# EAGLE design Schematic (EAGLE 5.10)
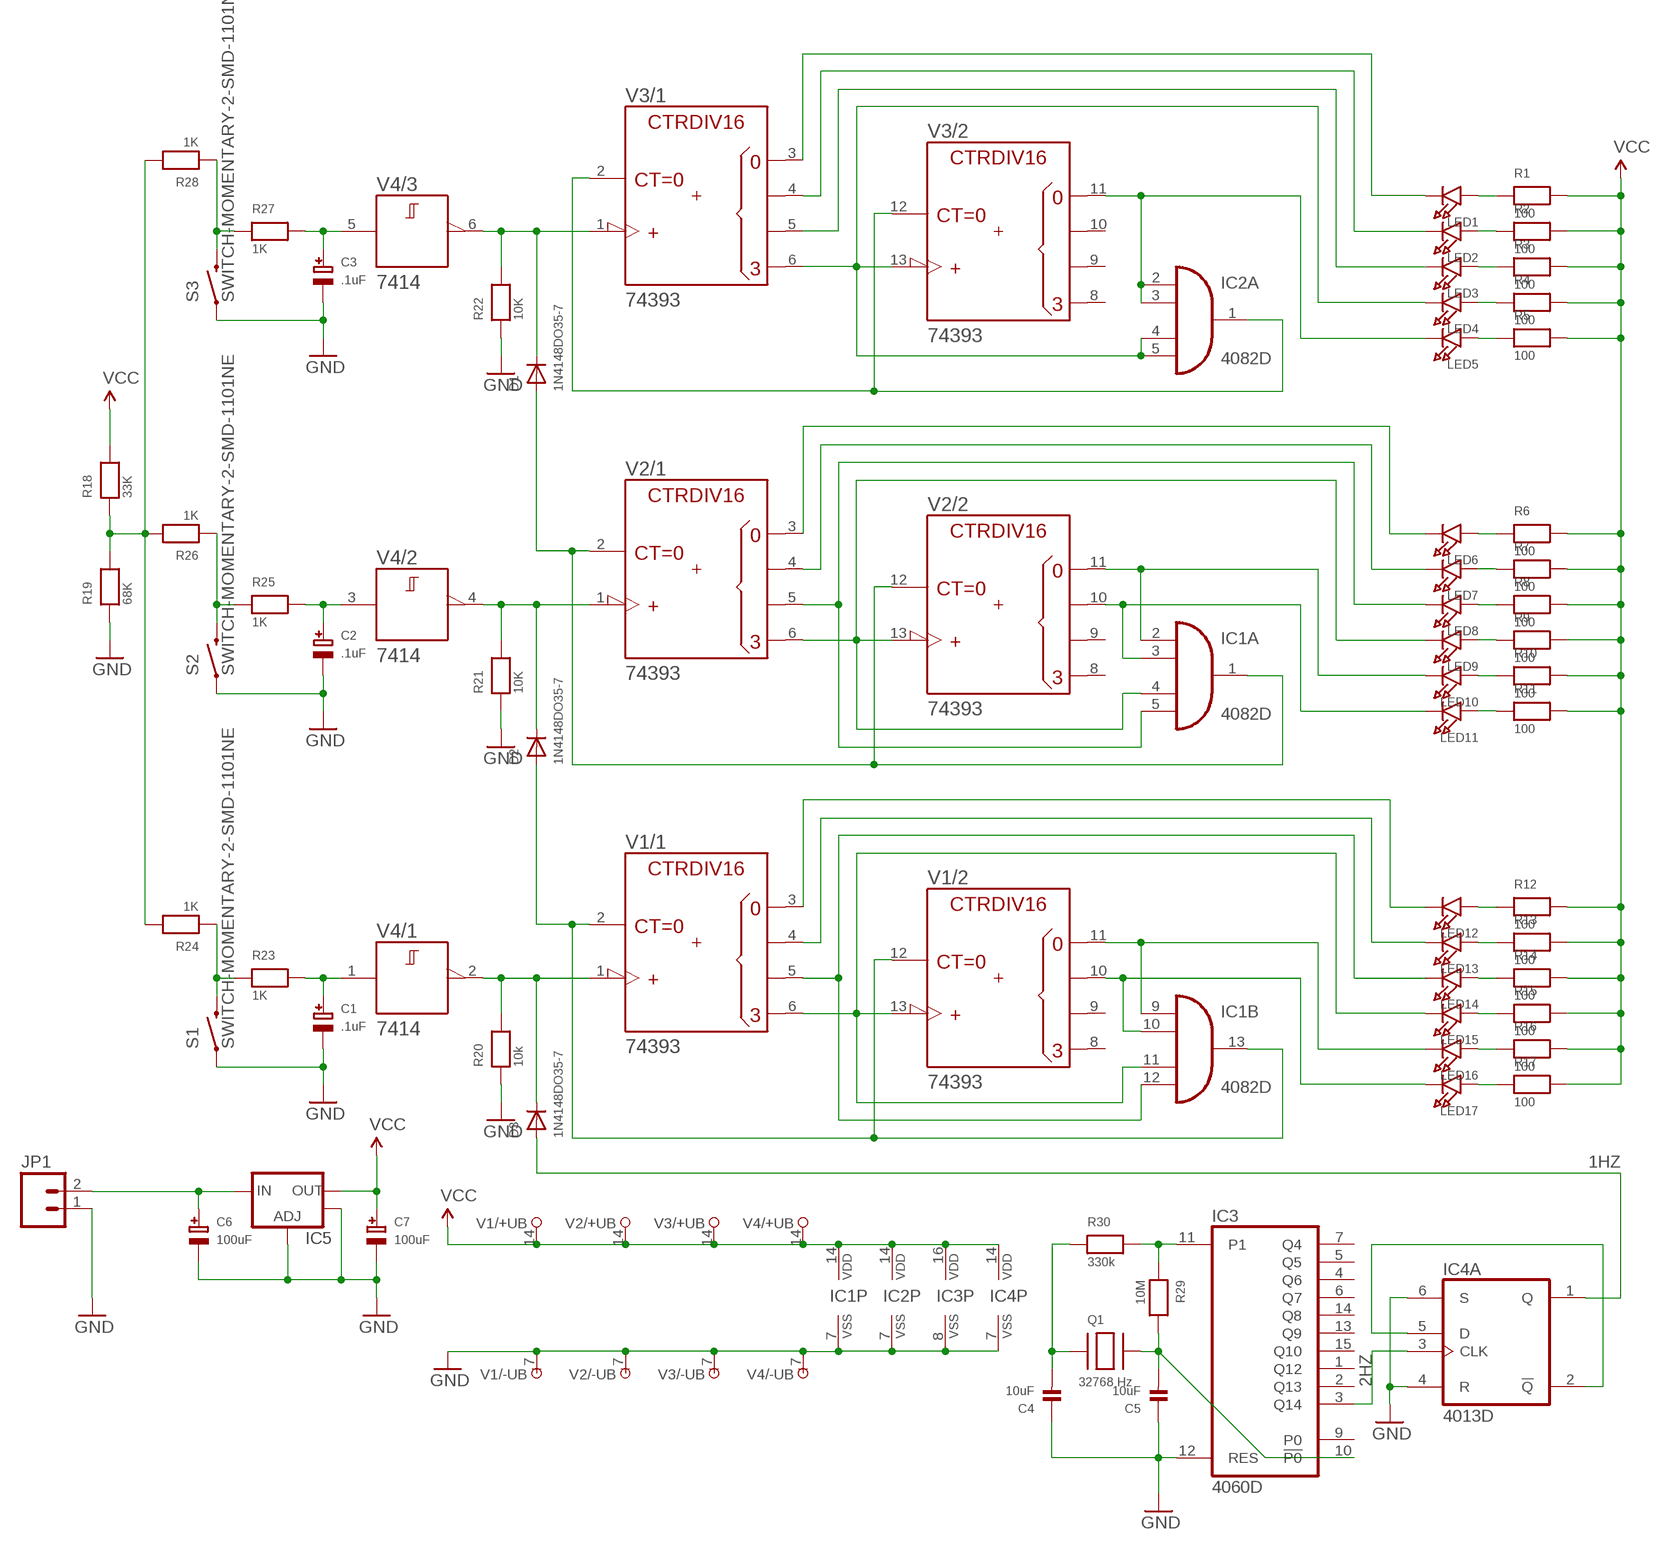
[diagram p0: schematic, sheet 1]

## Parts
C1  .1uF  CAP_TANTALUMA/3216_REFLOW  [EIA3216-18/A-R]
C2  .1uF  CAP_TANTALUMA/3216_REFLOW  [EIA3216-18/A-R]
C3  .1uF  CAP_TANTALUMA/3216_REFLOW  [EIA3216-18/A-R]
C4  10uF  CAP_CERAMIC0805  [0805]
C5  10uF  CAP_CERAMIC0805  [0805]
C6  100uF  CAP_ELECTROLYTICPANASONIC_D  [PANASONIC_D]
C7  100uF  CAP_ELECTROLYTICPANASONIC_D  [PANASONIC_D]
D1  1N4148DO35-7  DIODESOD-123  [SOD-123]
D2  1N4148DO35-7  DIODESOD-123  [SOD-123]
D3  1N4148DO35-7  DIODESOD-123  [SOD-123]
IC1  4082D  [SO14]
IC2  4082D  [SO14]
IC3  4060D  [SO16]
IC4  4013D  [SO14]
IC5  V_REG_LM1117SOT223  [SOT223]
JP1  M025MM  [SCREWTERMINAL-5MM-2]
LED1  LED0805  [CHIPLED_0805]
LED2  LED0805  [CHIPLED_0805]
LED3  LED0805  [CHIPLED_0805]
LED4  LED0805  [CHIPLED_0805]
LED5  LED0805  [CHIPLED_0805]
LED6  LED0805  [CHIPLED_0805]
LED7  LED0805  [CHIPLED_0805]
LED8  LED0805  [CHIPLED_0805]
LED9  LED0805  [CHIPLED_0805]
LED10  LED0805  [CHIPLED_0805]
LED11  LED0805  [CHIPLED_0805]
LED12  LED0805  [CHIPLED_0805]
LED13  LED0805  [CHIPLED_0805]
LED14  LED0805  [CHIPLED_0805]
LED15  LED0805  [CHIPLED_0805]
LED16  LED0805  [CHIPLED_0805]
LED17  LED0805  [CHIPLED_0805]
Q1  32768 Hz  XTAL-3.2X1.5  [XTAL3215]
R1  100  RESISTOR0805  [0805]
R2  100  RESISTOR0805  [0805]
R3  100  RESISTOR0805  [0805]
R4  100  RESISTOR0805  [0805]
R5  100  RESISTOR0805  [0805]
R6  100  RESISTOR0805  [0805]
R7  100  RESISTOR0805  [0805]
R8  100  RESISTOR0805  [0805]
R9  100  RESISTOR0805  [0805]
R10  100  RESISTOR0805  [0805]
R11  100  RESISTOR0805  [0805]
R12  100  RESISTOR0805  [0805]
R13  100  RESISTOR0805  [0805]
R14  100  RESISTOR0805  [0805]
R15  100  RESISTOR0805  [0805]
R16  100  RESISTOR0805  [0805]
R17  100  RESISTOR0805  [0805]
R18  33K  RESISTOR0805  [0805]
R19  68K  RESISTOR0805  [0805]
R20  10k  RESISTOR0805  [0805]
R21  10K  RESISTOR0805  [0805]
R22  10K  RESISTOR0805  [0805]
R23  1K  RESISTOR0805  [0805]
R24  1K  RESISTOR0805  [0805]
R25  1K  RESISTOR0805  [0805]
R26  1K  RESISTOR0805  [0805]
R27  1K  RESISTOR0805  [0805]
R28  1K  RESISTOR0805  [0805]
R29  10M  RESISTOR0805  [0805]
R30  330k  RESISTOR0805  [0805]
S1  SWITCH-MOMENTARY-2-SMD-1101NE  [TACTILE-SWITCH-1101NE]
S2  SWITCH-MOMENTARY-2-SMD-1101NE  [TACTILE-SWITCH-1101NE]
S3  SWITCH-MOMENTARY-2-SMD-1101NE  [TACTILE-SWITCH-1101NE]
V1  74393  [SO14]
V2  74393  [SO14]
V3  74393  [SO14]
V4  7414  [SO14]

## Nets
1HZ: D3.A IC4.1(A:Q)
2HZ: IC3.3(Q14) IC4.3(A:CLK)
GND: C1.- C2.- C3.- C4.1 C5.1 C6.- C7.- IC1.7(P:VSS) IC2.7(P:VSS) IC3.8(VSS) IC3.12(RES) IC4.4(A:R) IC4.6(A:S) IC4.7(P:VSS) IC5.1(ADJ) IC5.4(OUT) JP1.1 R19.1 R20.1 R21.1 R22.1 S1.P$1 S2.P$1 S3.P$1 V1.7(/-UB:-UB) V2.7(/-UB:-UB) V3.7(/-UB:-UB) V4.7(/-UB:-UB)
N$1: IC1.9(B:I0) LED16.C V1.11(/2:QA)
N$2: LED12.C V1.3(/1:QA)
N$3: IC1.12(B:I3) LED14.C V1.5(/1:QC)
N$4: C6.+ IC5.3(IN) JP1.2
N$6: LED13.A R13.1
N$7: LED7.C V2.4(/1:QB)
N$8: LED6.C V2.3(/1:QA)
N$9: LED12.A R12.1
N$10: LED14.A R14.1
N$11: LED15.A R15.1
N$12: LED16.A R16.1
N$13: LED17.A R17.1
N$14: R25.1 R26.1 S2.P$2
N$15: C5.2 IC3.10(!P0) Q1.P$2 R29.2
N$16: IC1.4(A:I2) LED9.C V2.6(/1:QD) V2.13(/2:A)
N$19: IC2.4(A:I2) IC2.5(A:I3) LED4.C V3.6(/1:QD) V3.13(/2:A)
N$20: IC1.3(A:I1) LED11.C V2.10(/2:QB)
N$23: LED1.C V3.3(/1:QA)
N$24: LED1.A R1.1
N$25: IC2.2(A:I0) IC2.3(A:I1) LED5.C V3.11(/2:QA)
N$26: LED2.C V3.4(/1:QB)
N$27: LED3.C V3.5(/1:QC)
N$28: R27.1 R28.1 S3.P$2
N$30: LED2.A R2.1
N$32: LED3.A R3.1
N$33: LED4.A R4.1
N$34: LED5.A R5.1
N$35: IC4.2(A:!Q) IC4.5(A:D)
N$38: IC1.5(A:I3) LED8.C V2.5(/1:QC)
N$40: IC1.2(A:I0) LED10.C V2.11(/2:QA)
N$41: C2.+ R25.2 V4.3(/2:A)
N$43: R18.1 R19.2 R24.2 R26.2 R28.2
N$44: R23.1 R24.1 S1.P$2
N$45: D2.C R21.2 V2.1(/1:A) V4.4(/2:Y)
N$46: IC3.11(P1) R29.1 R30.2
N$47: D2.A IC1.13(B:O) V1.2(/1:CLR) V1.12(/2:CLR)
N$49: D1.A IC1.1(A:O) V2.2(/1:CLR) V2.12(/2:CLR)
N$50: C3.+ R27.2 V4.5(/3:A)
N$51: C1.+ R23.2 V4.1(/1:A)
N$53: IC2.1(A:O) V3.2(/1:CLR) V3.12(/2:CLR)
N$56: C4.2 Q1.P$1 R30.1
N$57: D1.C R22.2 V3.1(/1:A) V4.6(/3:Y)
N$59: D3.C R20.2 V1.1(/1:A) V4.2(/1:Y)
N$61: LED6.A R6.1
N$62: LED7.A R7.1
N$63: LED8.A R8.1
N$64: LED9.A R9.1
N$65: LED10.A R10.1
N$66: LED11.A R11.1
N$70: IC1.10(B:I1) LED17.C V1.10(/2:QB)
N$74: IC1.11(B:I2) LED15.C V1.6(/1:QD) V1.13(/2:A)
N$76: LED13.C V1.4(/1:QB)
VCC: C7.+ IC1.14(P:VDD) IC2.14(P:VDD) IC3.16(VDD) IC4.14(P:VDD) IC5.2(OUT) R1.2 R2.2 R3.2 R4.2 R5.2 R6.2 R7.2 R8.2 R9.2 R10.2 R11.2 R12.2 R13.2 R14.2 R15.2 R16.2 R17.2 R18.2 V1.14(/+UB:+UB) V2.14(/+UB:+UB) V3.14(/+UB:+UB) V4.14(/+UB:+UB)
Unconnected: IC2.9(B:I0) IC2.10(B:I1) IC2.11(B:I2) IC2.12(B:I3) IC2.13(B:O) IC3.1(Q12) IC3.2(Q13) IC3.4(Q6) IC3.5(Q5) IC3.6(Q7) IC3.7(Q4) IC3.9(P0) IC3.13(Q9) IC3.14(Q8) IC3.15(Q10) IC4.8(B:S) IC4.9(B:D) IC4.10(B:R) IC4.11(B:CLK) IC4.12(B:!Q) IC4.13(B:Q) V1.8(/2:QD) V1.9(/2:QC) V2.8(/2:QD) V2.9(/2:QC) V3.8(/2:QD) V3.9(/2:QC) V3.10(/2:QB) V4.8(/4:Y) V4.9(/4:A) V4.10(/5:Y) V4.11(/5:A) V4.12(/6:Y) V4.13(/6:A)

## Library data of the parts
C1-C3 = microbuilder:CAP_TANTALUM: Tantalum Capacitors Wave footprints have larger pads and are meant to be used for hand soldering. Reflow footprints are optimised for solder paste and a reflow oven. EIA3216-18/A-[R/W] - Size A / 3216-18 / 1206 footprint 4.7µF 25V 10% Tantalum Capacitor 10µF 16V 10% Tantalum Capacitor [Digikey: 495-2236-2-ND] EIA3528-21/B-[R/W] - Size B / 3528-21 47µF 10V 10% Tantalum Capactior [Digikey: 495-2216-1-ND] EIA6032-28/C-[R/W] - Size C / 6032-28 10µF 35V 20% Tantalum Capacitor [Digikey: 495-2285-1-ND] 100µF 16V 10% Tantalum Capactior [Digikey: 399-5214-1-ND]
C4 C5 = microbuilder:CAP_CERAMIC: Ceramic Capacitors 0402 - 0402 Surface Mount Capacitors 0.1uF 10V 10% [Digikey: 490-1318-2-ND] 0603 - 0603 Surface Mount Capacitors 16 pF 50V 5% [Digikey: 445-5051-2-ND] 22 pF 50V [Digikey: PCC220ACVTR-ND] 33 pF 50V 5% [Digikey: 490-1415-1-ND] 56pF 50V 5% [Digikey: 490-1421-1-ND] 220pF 50V 5% [Digikey: 445-1285-1-ND] 680 pF 50V 2200 pF 50V 5% C0G [Digikey: 445-1297-1-ND] 5600 pF 100V 5% X7R [Digikey: 478-3711-1-ND] 0.1 µF 25V 10% [Digikey: PCC2277TR-ND] 0.22 µF 16V 10% X7R [Digikey: 445-1318-1-ND] 1.0 µF 25V 10% [Digikey: 445-5146-2-ND] 0603 - RF Specific 3pF 250V +/-0.1pF RF [Digikey: 712-1347-1-ND] 18 pF 250V 5% [Digikey: 478-3505-1-ND or 712-1322-1-ND] 56 pF 250V 5% C0G RF [Digikey: 490-4867-1-ND] 68 pF 250V RF [Digikey: 490-4868-1-ND] 0805 - 0805 Surface Mount Capacitors 220 pF 250V 2% RF Ceramic Capacitor [Digikey: 712-1398-1-ND] 1000 pF 50V 2% NP0 Ceramic Capacitor [Digikey: 478-3760-1-ND] 0.1 µF 25V 10% Ceramic Capacitor [Digikey: PCC1828TR-ND] 1.0 µF 16V 10% Ceramic Capacitor[Digikey: 490-1691-2-ND] 10.0 µF 10V 10% Ceramic Capacitor[Digikey: 709-1228-1-ND] 1206 - 1206 Surface Mount Capacitors
C6 C7 = microbuilder:CAP_ELECTROLYTIC: Electrolytic Capacitors PANASONIC_C - Size C Panasonic Electrolytic Aluminum Capacitor 47µF 16V 20% Electrolytic Capacitor [Digikey: PCE3890TR-ND] PANASONIC_D - Size D Panasonic Electrolytic Aluminum Capacitor 100µF 25V 20% Electrolytic Capacitor [Digikey: PCE3898TR-ND]
D1-D3 = microbuilder:DIODE: Diode SMADIODE - SMA Surface Mount Package 20V 1A Schottky Diode Digikey (500mV @ 1A, 500uA Vr @ 20V): 641-1014-6-ND SOD-123 30V 500mA (430mV Vf, 130uA Vr @ 30V) Schottky Diode - Digikey: B0530W-FDICT-ND SOD-323 10V 570mA (380mV Vf, 3ns) Schottky Diode - Digikey: ZLLS410CT-ND SOD-523 30V 30mA Schottky Diode (RB751S-40TE61) - Digikey: RB751S-40TE61CT-ND SOT23-R/W - SOT23 Package (R = Solder Paste/Reflow Ovens, W = Hand-Soldering) BAT54Film 40V 300mA - Digikey: 497-7162-1-ND DO-1N4148 Through Hole Small Current Diode (any model)
IC1 IC2 = 40xx:4082: Dual 4-input AND
IC3 = 40xx:4060: 14-stage binary/ripple COUNTER
IC4 = 40xx:4013: Dual D FLIP FLOP, set/reset
IC5 = SparkFun:V_REG_LM1117: Voltage Regulator LM1117 Standard adjustable voltage regulator but in SMD form. Spark Fun Electronics SKU : COM-00595
JP1 = SparkFun:M02: Header 2 Standard 2-pin 0.1" header. Use with straight break away headers (SKU : PRT-00116), right angle break away headers (PRT-00553), swiss pins (PRT-00743), machine pins (PRT-00117), and female headers (PRT-00115). Molex polarized connector foot print use with SKU : PRT-08233 with associated crimp pins and housings.
LED1-LED17 = microbuilder:LED: LED 0603 - 0603 Surface Mount Package Green LED - Low Power (3.9mcd, 2ma, 1.7Vf) Orange LED - Low Power (9.8mcd, 2ma, 1.8Vf) Red LED - Low Power (5mcd, 2ma, 1.8Vf) Yellow LED - Low Power (7mcd, 2ma, 1.8Vf) 0805 - 0805 Surface Mount Package 20mA: Red LED (104mcd, 20mA, Diffused) - LS R976 [Digikey: 475-1278-6-ND] Red LED (12mcd, 20mA, 2.0Vf, Clear) - APT2012EC [Digikey: 754-1128-1-ND] Green LED (15mcd, 20mA, 2.2Vf, Clear) - APT2012GC [Digikey: 754-1131-1-ND] Orange LED (160mcd, 20mA, 2.1Vf, Clear) - APT2012SECK [Digikey: 754-1130-1-ND] 2mA: Red LED (8.8mcd, 2mA, 1.8Vf, Clear) - Low Power [Digikey: 475-2510-1-ND] Green LED (5mcd, 2mA, 1.8Vf, Clear) - Low Power [Digikey: 475-2730-1-ND] Yellow LED (11.3mcd, 2mA, 1.8Vf, Clear) - Low Power [Digikey: 475-2555-1-ND] 1206 - 1206 Surface Mount Package Green LED (26mcd, 20mA, Diffused) - LG N971 [Digikey: 475-1407-6-ND] Red LED (15mcd, 20mA, Diffused) - LH N974 [Digikey: 475-1416-6-ND]
Q1 = adafruit:XTAL: Low cost SMT crystals, no capacitors included http://www.ladyada.net/library/eagle
R1-R30 = microbuilder:RESISTOR: Resistors 0402 - 0402 Surface Mount Package 10.0K 1% 1/16W [Digikey: 311-10.0KLRTR-ND] 0603 - 0603 Surface Mount Package 0 Ohm 1/10 Watt 1% Resistor 15 Ohm 1/10 Watt 1% Resistor 33 Ohm 1/10 Watt 1% Resistor 49.9 Ohm 1/10 Watt 1% Resistor 100 Ohm 1/10 Watt 1% Resistor 150 Ohm 1/10 Watt 1% Resistor 240 Ohm 1/10 Watt 1% Resistor 390 Ohm 1/10 Watt 1% Resistor 560 Ohm 1/10 Watt 1% Resistor 750 Ohm 1/10 Watt 1% Resistor 1.0K Ohm 1/10 Watt 1% Resistor 1.5K Ohm 1/10 Watt 1% Resistor 2.0K Ohm 1/10 Watt 1% Resistor 4.7K Ohm 1/10 Watt 1% Resistor 10.0K Ohm 1/10 Watt 1% Resistor 20.0K Ohm 1/10 Watt 1% Resistor 33.0K Ohm 1/10 Watt 1% Resistor 100.0K Ohm 1/10 Watt 1% Resistor 0805 - 0805 Surface Mount Package 0 Ohm 1/8 Watt 1% Resistor 33 Ohm 1/8 Watt 1% Resistor 100 Ohm 1/8 Watt 1% Resistor 150 Ohm 1/8 Watt 1% Resistor 200 Ohm 1/8 Watt 1% Resistor 240 Ohm 1/8 Watt 1% Resistor 330 Ohm 1/8 Watt 1% Resistor 390 Ohm 1/8 Watt 1% Resistor 470 Ohm 1/8 Watt 1% Resistor 1.0K Ohm 1/8 Watt 1% Resistor 1.5K Ohm 1/8 Watt 1% Resistor 2.0K Ohm 1/8 Watt 1% Resistor 4.7K Ohm 1/8 Watt 1% Resistor 5.1K Ohm 1/8 Watt 1% Resistor 5.6K Ohm 1/8 Watt 1% Resistor 10.0K Ohm 1/8 Watt 1% Resistor 22.0K Ohm 1/8 Watt 1% Resistor 33.0K Ohm 1/8 Watt 1% Resistor 100K Ohm 1/8 Watt 1% Resistor 1206 - 1206 Surface Mount Package
S1-S3 = SparkFun:SWITCH-MOMENTARY-2
V1-V3 = 74ttl-din:74*393: Dual 4-bit decade and binary COUNTER
V4 = 74ttl-din:74*14: Hex schmitt trigger INVERTER

## Board
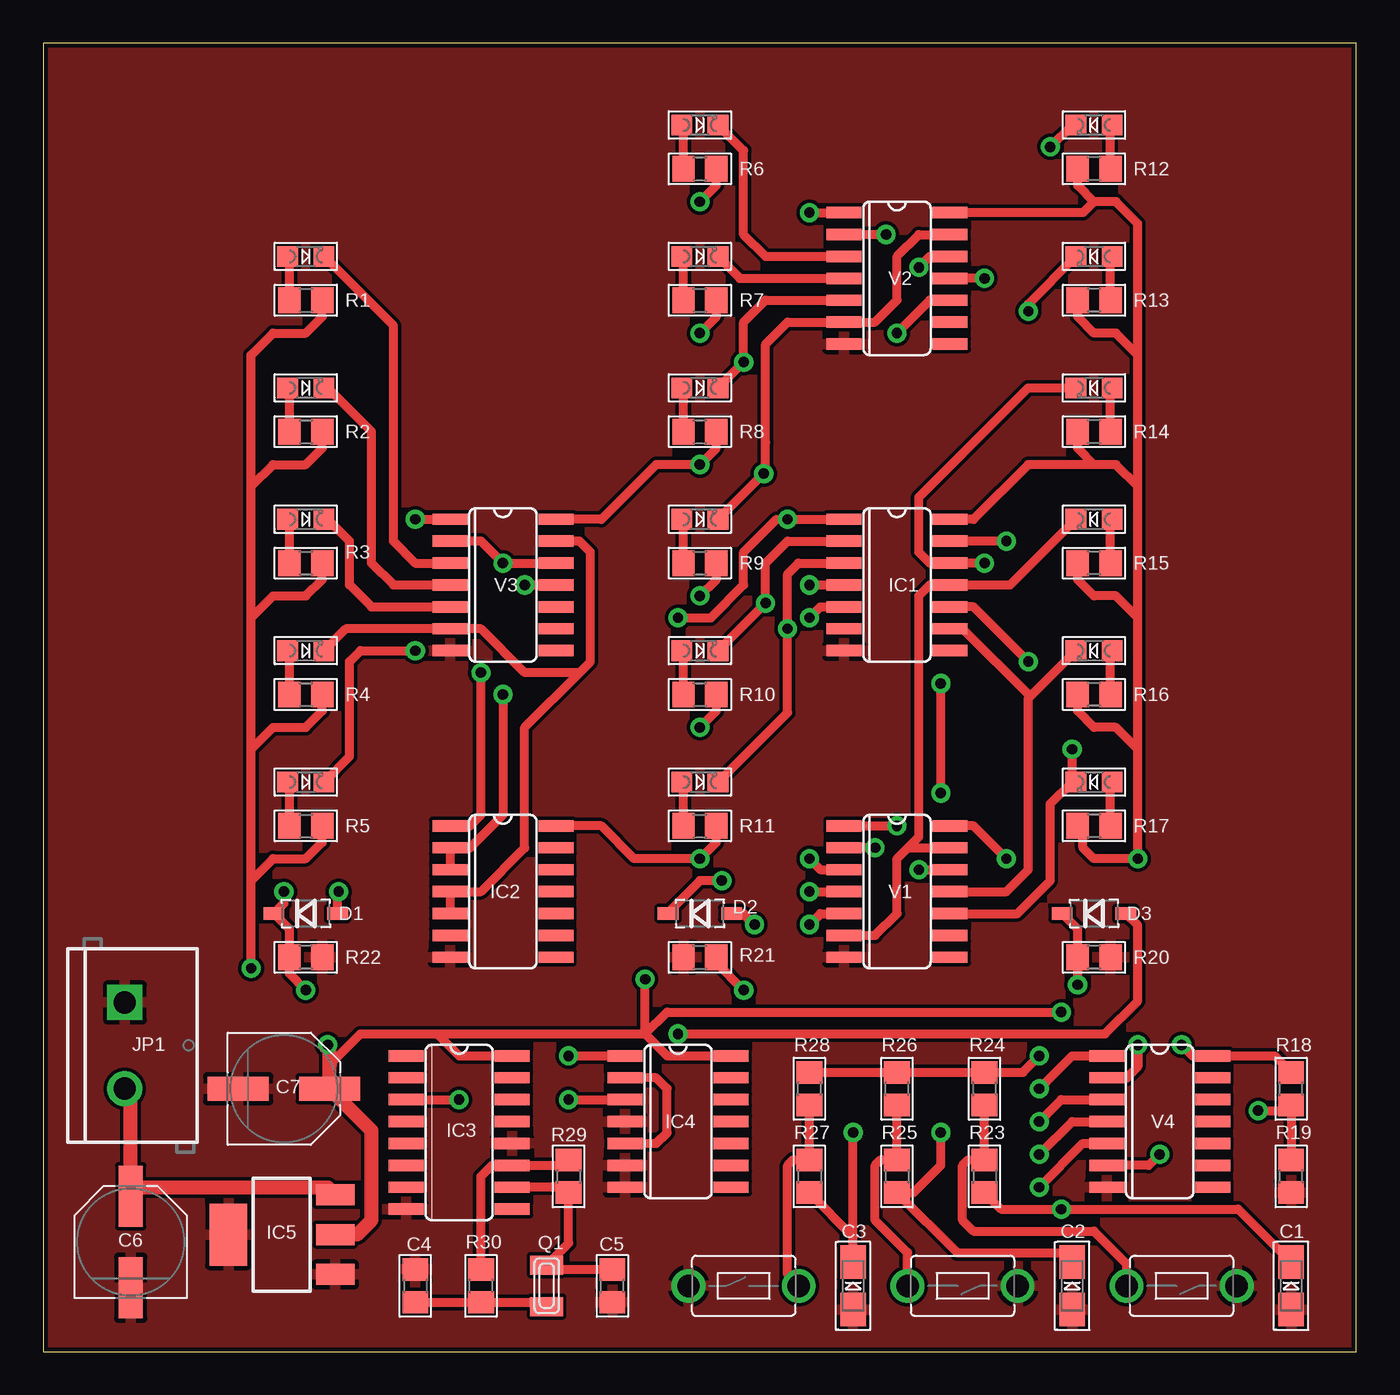
[diagram p1: board, top side]
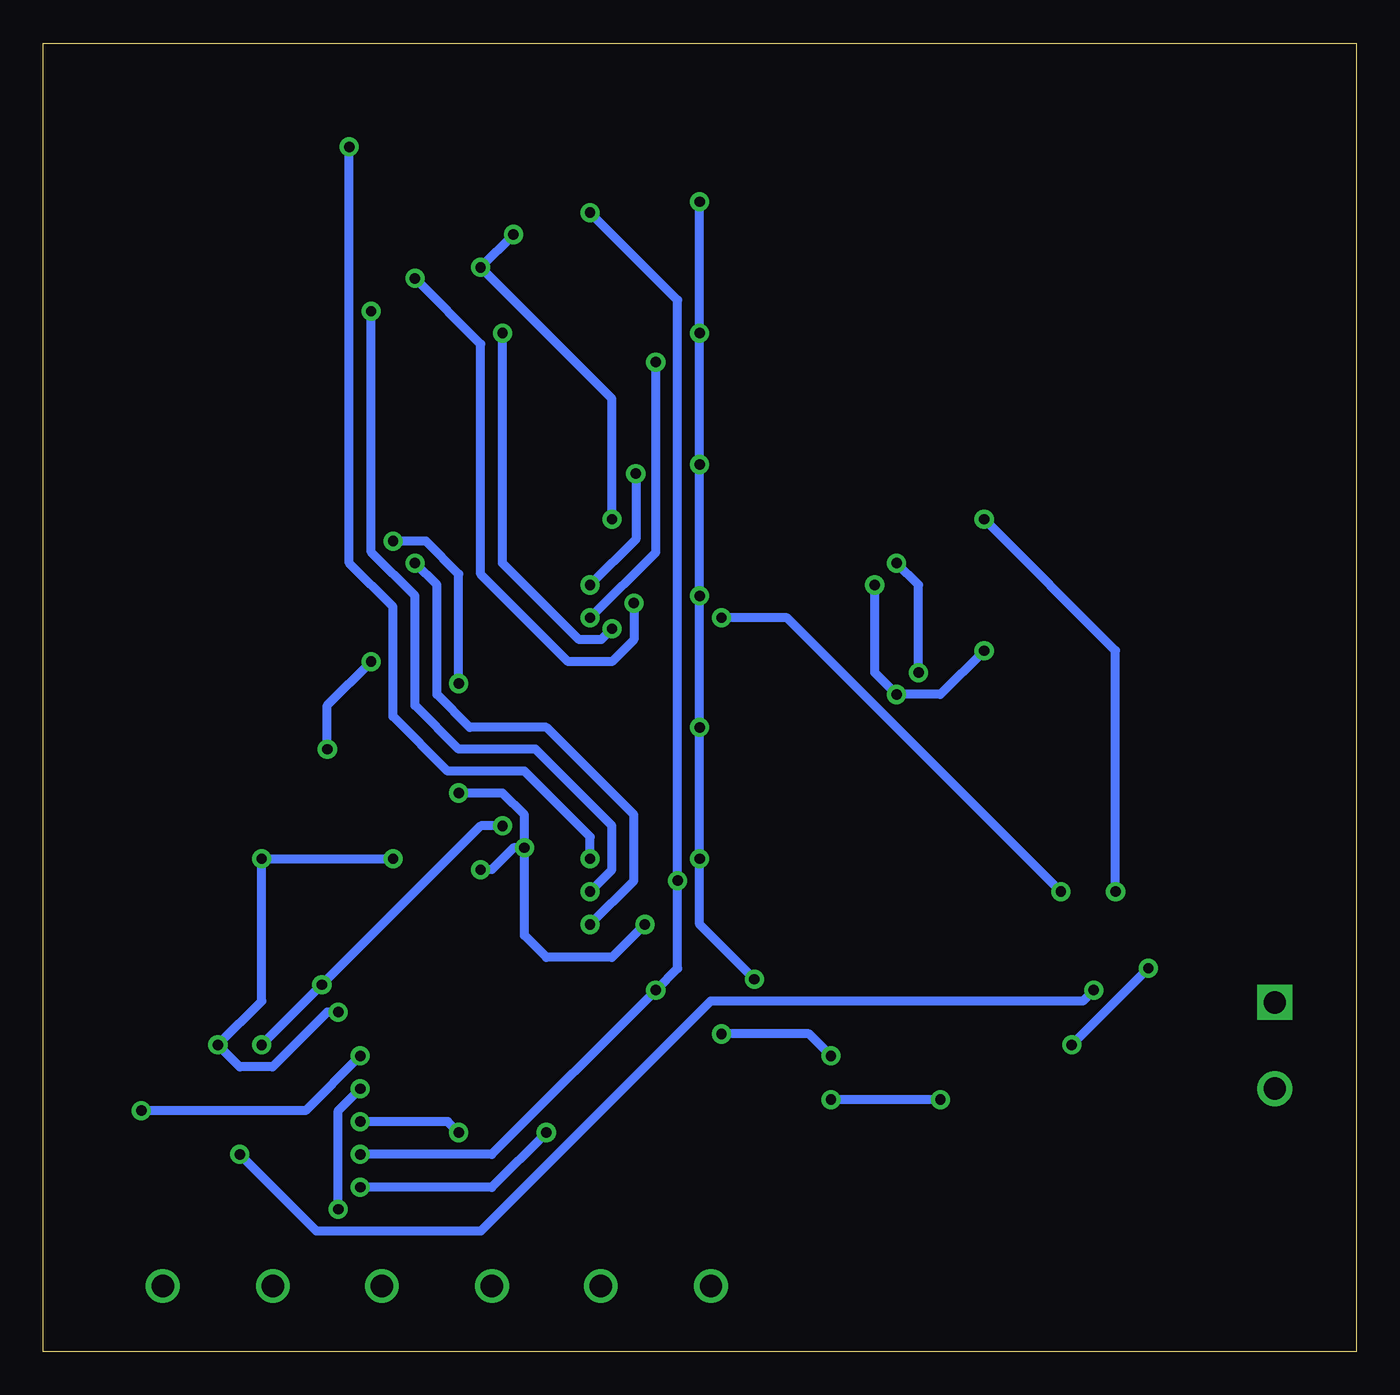
[diagram p2: board, bottom side, seen from below]

Size 76.18 x 75.87 mm. Coordinates in mm from the lower left corner, seen from the top.
Outline: 0,0 76.18,0 76.18,75.87 0,75.87 0,0
Copper layers (1*16): Top 0.035mm / dielectric 1.5mm / Bottom 0.035mm
Design rules "SparkFun": minimum track width 8mil, minimum drill 20mil, track to track 8mil, track to pad 8mil, pad to pad 8mil, via to via 8mil, smd to smd 8mil, copper to edge 10mil, drill to drill 8mil, minimum pad ring 12mil, minimum via ring 10mil, stop-mask expansion 4mil, vias tented up to drill 25mil, thermal gap 10mil

### Footprints (pad centres in the part's own frame; a part is rotated, then mirrored left to right if it is on the bottom)
EIA3216-18/A-R = smd 1.95 x 1.5: + 1.375,0; - -1.375,0
0805 = smd 1.3 x 1.5: 1 -0.95,0; 2 0.95,0
PANASONIC_D = smd 3.556 x 1.4: + 2.654,0; - -2.654,0
SOD-123 = smd 1.2 x 0.7: A 1.85,0; C -1.85,0
SO14 = smd 0.66 x 2.032: 1 -3.81,-3.073; 2 -2.54,-3.073; 3 -1.27,-3.073; 4 0,-3.073; 5 1.27,-3.073; 6 2.54,-3.073; 7 3.81,-3.073; 8 3.81,3.073; 9 2.54,3.073; 10 1.27,3.073; 11 0,3.073; 12 -1.27,3.073; 13 -2.54,3.073; 14 -3.81,3.073
SO16 = smd 0.66 x 2.032: 1 -4.445,-3.073; 2 -3.175,-3.073; 3 -1.905,-3.073; 4 -0.635,-3.073; 5 0.635,-3.073; 6 1.905,-3.073; 7 3.175,-3.073; 8 4.445,-3.073; 9 4.445,3.073; 10 3.175,3.073; 11 1.905,3.073; 12 0.635,3.073; 13 -0.635,3.073; 14 -1.905,3.073; 15 -3.175,3.073; 16 -4.445,3.073
SOT223 = smd 1.219 x 2.235: 1 -2.311,-3.099; 2 0,-3.099; 3 2.311,-3.099 | smd 3.6 x 2.2: 4 0,3.099
SCREWTERMINAL-5MM-2 = drill 1.3 pad 2.032 square: 1 0,0 | drill 1.3 pad 2.032 round: 2 5,0
CHIPLED_0805 = smd 1.2 x 1.2: A 0,-1.05; C 0,1.05
XTAL3215 = smd 1.1 x 1.9: P$1 1.2,0; P$2 -1.2,0
TACTILE-SWITCH-1101NE = drill 1.3 round: P$1 -3.2,0; P$2 3.2,0

### Placement (x,y rotation side)
C1  72.39,3.81 90 top
C2  59.69,3.81 90 top
C3  46.99,3.81 90 top
C4  21.59,3.81 270 top
C5  33.02,3.81 90 top
C6  5.08,6.35 90 top
C7  13.97,15.24 0 top
D1  15.24,25.4 0 top
D2  38.1,25.4 0 top
D3  60.96,25.4 0 top
IC1  49.53,44.45 270 top
IC2  26.67,26.67 270 top
IC3  24.13,12.7 270 top
IC4  36.83,13.34 270 top
IC5  13.85,6.78 90 top
JP1  4.74,20.25 270 top
LED1  15.24,63.5 270 top
LED2  15.24,55.88 270 top
LED3  15.24,48.26 270 top
LED4  15.24,40.64 270 top
LED5  15.24,33.02 270 top
LED6  38.1,71.12 270 top
LED7  38.1,63.5 270 top
LED8  38.1,55.88 270 top
LED9  38.1,48.26 270 top
LED10  38.1,40.64 270 top
LED11  38.1,33.02 270 top
LED12  60.96,71.12 90 top
LED13  60.96,63.5 90 top
LED14  60.96,55.88 90 top
LED15  60.96,48.26 90 top
LED16  60.96,40.64 90 top
LED17  60.96,33.02 90 top
Q1  29.21,3.81 270 top
R1  15.24,60.96 0 top
R2  15.24,53.34 0 top
R3  15.24,45.72 0 top
R4  15.24,38.1 0 top
R5  15.24,30.48 0 top
R6  38.1,68.58 0 top
R7  38.1,60.96 0 top
R8  38.1,53.34 0 top
R9  38.1,45.72 0 top
R10  38.1,38.1 0 top
R11  38.1,30.48 0 top
R12  60.96,68.58 180 top
R13  60.96,60.96 180 top
R14  60.96,53.34 180 top
R15  60.96,45.72 180 top
R16  60.96,38.1 180 top
R17  60.96,30.48 180 top
R18  72.39,15.24 90 top
R19  72.39,10.16 90 top
R20  60.96,22.86 180 top
R21  38.1,22.86 0 top
R22  15.24,22.86 180 top
R23  54.61,10.16 270 top
R24  54.61,15.24 90 top
R25  49.53,10.16 270 top
R26  49.53,15.24 90 top
R27  44.45,10.16 270 top
R28  44.45,15.24 90 top
R29  30.48,10.16 270 top
R30  25.4,3.81 90 top
S1  66.04,3.81 180 top
S2  53.34,3.81 180 top
S3  40.64,3.81 0 top
V1  49.53,26.67 270 top
V2  49.53,62.23 270 top
V3  26.67,44.45 270 top
V4  64.77,13.34 270 top

### Tracks (layer width: path | path; a pad name or v marks a point on that pad's centre or on a via)
1HZ  (via drill 0.6)
  Top 0.508: v30.48,17.14 IC4.1 | v36.83,18.41 61.59,18.41 63.5,20.32 63.5,24.71 D3.A
  Bottom 0.508: v30.48,17.14 31.75,18.41 v36.83,18.41
2HZ  (via drill 0.6)
  Top 0.508: IC3.3 v24.13,14.61 | v30.48,14.61 IC4.3
  Bottom 0.508: v24.13,14.61 v30.48,14.61
GND
  pour Top: 0,0 76.2,0 76.2,76.2 0,76.2
N$1
  Top 0.508: 57.26,37.99 57.15,37.88 57.15,27.94 55.88,26.67 V1.11 | 57.26,37.99 LED16.C | IC1.9 53.34,41.91 57.26,37.99
N$2  (via drill 0.6)
  Top 0.508: V1.3 45.09,27.94 v44.45,28.57 | v58.42,69.85 59.69,71.12 LED12.C
  Bottom 0.508: v44.45,28.57 44.45,29.84 48.26,33.66 52.7,33.66 55.88,36.83 55.88,43.18 58.42,45.72 v58.42,69.85
N$3  (via drill 0.6)
  Top 0.508: V1.5 45.09,25.4 v44.45,24.77 | v54.61,45.72 IC1.12 51.44,45.72 50.8,46.35 50.8,49.53 57.15,55.88 LED14.C
  Bottom 0.508: v44.45,24.77 41.91,27.3 41.91,31.11 46.99,36.2 51.44,36.2 53.34,38.1 53.34,44.45 v54.61,45.72
N$4
  Top 0.508: C6.+ 5.08,9.53
  Top 0.813: JP1.2 5.08,14.9 5.08,9.53 16.52,9.53 IC5.3
N$6
  Top 0.508: R13.1 61.91,63.4 LED13.A
N$7
  Top 0.508: LED7.C 40.42,62.23 V2.4
N$8
  Top 0.508: 39.37,71.12 LED6.C 40.64,69.63 40.64,64.77 41.91,63.5 V2.3
N$9
  Top 0.508: R12.1 61.91,71.02 LED12.A
N$10
  Top 0.508: R14.1 61.91,55.78 LED14.A
N$11
  Top 0.508: R15.1 61.91,48.16 LED15.A
N$12
  Top 0.508: R16.1 61.91,40.54 LED16.A
N$13
  Top 0.508: R17.1 61.91,32.92 LED17.A
N$14
  Top 0.508: R26.1 R25.1 48.58,11.11 48.26,10.79 48.26,7.62 50.14,5.74 S2.P$2
N$15
  Top 0.508: C5.2 29.46,4.76 Q1.P$2 30.48,6.28 R29.2 30.16,9.53 IC3.10
N$16  (via drill 0.6)
  Top 0.508: LED9.C v41.8,50.91 41.91,51.02 41.91,52.7 41.91,58.42 43.18,59.69 V2.6 48.26,59.69 49.53,60.96 49.53,63.5 50.8,64.77 V2.13 | v44.45,44.45 IC1.4
  Bottom 0.508: v44.45,44.45 41.8,47.1 v41.8,50.91
N$19
  Top 0.508: V3.13 31.11,46.99 31.75,46.35 31.75,40.01 31.11,39.37 | 31.11,39.37 27.94,39.37 25.4,41.91 V3.6 17.56,41.91 LED4.C | IC2.5 IC2.4 25.4,26.67 27.94,29.21 27.94,36.2 31.11,39.37
N$20  (via drill 0.6)
  Top 0.508: IC1.3 43.81,45.72 43.18,45.09 v43.18,41.91 43.18,37.05 LED11.C | v49.53,59.05 51.44,60.96 V2.10
  Bottom 0.508: v43.18,41.91 43.81,41.27 45.09,41.27 49.53,45.72 v49.53,59.05
N$23
  Top 0.508: V3.3 21.59,45.72 20.32,46.99 20.32,59.47 LED1.C
N$24
  Top 0.508: LED1.A 14.29,63.4 R1.1
N$25  (via drill 0.6)
  Top 0.508: IC2.3 IC2.2 24.77,29.21 26.67,31.11 v26.67,38.1 | LED5.C 17.78,34.51 17.78,40.01 18.41,40.64 v21.59,40.64 | v27.94,44.45 V3.11
  Bottom 0.508: v21.59,40.64 24.13,38.1 v26.67,38.1 27.94,39.37 v27.94,44.45
N$26
  Top 0.508: LED2.C 16.51,55.88 19.05,53.34 19.05,45.72 20.32,44.45 V3.4
N$27
  Top 0.508: LED3.C 16.51,48.26 17.78,46.99 17.78,44.45 19.05,43.18 V3.5
N$28
  Top 0.508: R28.1 R27.1 43.49,11.11 43.18,10.79 43.18,4.47 S3.P$2
N$30
  Top 0.508: LED2.A 14.29,55.78 R2.1
N$32
  Top 0.508: LED3.A 14.29,48.16 R3.1
N$33
  Top 0.508: LED4.A 14.29,40.54 R4.1
N$34
  Top 0.508: LED5.A 14.29,32.92 R5.1
N$35
  Top 0.508: IC4.2 35.56,15.88 36.2,15.24 36.2,12.7 35.56,12.06 IC4.5
N$38  (via drill 0.6)
  Top 0.508: V2.5 41.91,60.96 40.64,59.69 v40.64,57.37 LED8.C | v44.45,42.55 45.09,43.18 IC1.5
  Bottom 0.508: v40.64,57.37 40.64,46.35 v44.45,42.55
N$40  (via drill 0.6)
  Top 0.508: IC1.2 43.18,46.99 41.91,45.72 v41.91,43.4 LED10.C | v54.61,62.23 V2.11
  Bottom 0.508: v41.91,43.4 41.91,41.27 43.18,40.01 45.72,40.01 50.8,45.09 50.8,58.42 v54.61,62.23
N$41  (via drill 0.6)
  Top 0.508: C2.+ 59.16,5.71 53.02,5.71 R25.2 50.48,9.21 52.07,10.79 v52.07,12.7 | V4.3 59.05,14.61 v57.78,13.34
  Bottom 0.508: v52.07,12.7 52.7,13.34 v57.78,13.34
N$43  (via drill 0.6)
  Top 0.508: R28.2 R26.2 R24.2 56.84,16.19 v57.78,17.14 | R19.2 R18.1 72.07,13.97 v70.48,13.97
  Bottom 0.508: v57.78,17.14 60.96,13.97 v70.48,13.97
N$44
  Top 0.508: R24.1 R23.1 53.66,11.11 53.34,10.79 53.34,7.62 53.98,6.99 60.96,6.99 62.84,5.11 S1.P$2
N$45  (via drill 0.6)
  Top 0.508: V4.4 59.69,13.34 v57.78,11.43 | D2.C 36.25,25.45 38.1,27.3 v39.37,27.3 | v44.45,66.04 V2.1 | v40.64,20.95 39.05,22.55 R21.2
  Bottom 0.508: v57.78,11.43 50.16,11.43 v40.64,20.95 39.37,22.23 v39.37,27.3 39.37,60.96 v44.45,66.04
N$46
  Top 0.508: R29.1 30.16,10.79 IC3.11 26.04,10.79 25.4,10.16 R30.2
N$47  (via drill 0.6)
  Top 0.508: v48.26,29.21 V1.2 | v50.8,27.94 V1.12 | v55.88,46.99 IC1.13 | v52.07,32.38 v52.07,38.73 | D2.A 40.64,25.4 v41.27,24.77
  Bottom 0.508: v48.26,29.21 48.9,29.21 50.16,27.94 v50.8,27.94 | v41.27,24.77 43.18,22.86 46.99,22.86 48.26,24.13 v48.26,29.21 | v55.88,46.99 53.98,46.99 52.07,45.09 v52.07,38.73 | v52.07,32.38 49.53,32.38 48.26,31.11 v48.26,29.21
N$49  (via drill 0.6)
  Top 0.508: D1.A 17.09,26.61 v17.14,26.67 | V2.12 51.44,63.5 v50.8,62.87 | v48.9,64.77 V2.2 | v36.83,42.55 38.73,42.55 40.64,44.45 40.64,46.35 42.55,48.26 v43.18,48.26 44.45,48.26 IC1.1
  Bottom 0.508: v17.14,26.67 33.02,42.55 v36.83,42.55 | v48.9,64.77 v50.8,62.87 43.18,55.24 v43.18,48.26
N$50  (via drill 0.6)
  Top 0.508: 46.99,6.67 R27.2 | C3.+ 46.99,6.67 | 46.99,6.67 v46.99,12.7 | V4.5 60.33,12.06 v57.78,9.53
  Bottom 0.508: v46.99,12.7 50.16,9.53 v57.78,9.53
N$51  (via drill 0.6)
  Top 0.508: C1.+ 69.32,8.26 v59.05,8.26 55.56,8.26 R23.2 | v57.78,15.24 59.69,17.14 V4.1
  Bottom 0.508: v57.78,15.24 59.05,13.97 v59.05,8.26
N$53  (via drill 0.6)
  Top 0.508: V3.2 25.4,46.99 v26.67,45.72 V3.12 | v25.4,39.37 25.4,31.11 24.77,30.48 IC2.1
  Bottom 0.508: v26.67,45.72 25.4,44.45 v25.4,39.37
N$56
  Top 0.508: Q1.P$1 28.96,2.86 R30.1 C4.2
N$57  (via drill 0.6)
  Top 0.508: V4.6 64.14,10.79 v64.77,11.43 | v15.24,20.95 14.29,21.91 R22.2 14.29,24.5 D1.C 13.97,25.98 v13.97,26.67 | v21.59,48.26 V3.1
  Bottom 0.508: v64.77,11.43 60.33,6.99 50.8,6.99 37.47,20.32 15.88,20.32 v15.24,20.95 | v21.59,48.26 13.97,40.64 v13.97,26.67
N$59  (via drill 0.6)
  Top 0.508: V4.2 62.87,15.88 63.5,16.51 v63.5,17.78 | D3.C 60.01,24.5 R20.2 v60.01,21.27 | V1.1 v49.53,30.48
  Bottom 0.508: v63.5,17.78 v60.01,21.27 50.8,30.48 v49.53,30.48
N$61
  Top 0.508: LED6.A 37.15,71.02 R6.1
N$62
  Top 0.508: LED7.A 37.15,63.4 R7.1
N$63
  Top 0.508: LED8.A 37.15,55.78 R8.1
N$64
  Top 0.508: LED9.A 37.15,48.16 R9.1
N$65
  Top 0.508: LED10.A 37.15,40.54 R10.1
N$66
  Top 0.508: LED11.A 37.15,32.92 R11.1
N$70  (via drill 0.6)
  Top 0.508: V1.10 56.52,25.4 58.42,27.3 58.42,31.75 59.69,33.02 LED17.C 59.69,33.24 v59.69,34.92 | IC1.10 53.98,43.18 v57.15,40.01
  Bottom 0.508: v57.15,40.01 59.69,37.47 v59.69,34.92
N$74
  Top 0.508: V1.6 48.26,24.13 49.53,25.4 49.53,28.57 50.16,29.21 | 50.16,29.21 V1.13 | 50.16,29.21 50.8,29.84 50.8,43.81 51.44,44.45 IC1.11 56.1,44.45 LED15.C
N$76  (via drill 0.6)
  Top 0.508: v44.45,26.67 V1.4 | LED13.C 57.15,60.74 v57.15,60.33
  Bottom 0.508: v44.45,26.67 43.18,27.94 43.18,30.48 47.62,34.92 52.07,34.92 54.61,37.47 54.61,43.81 57.15,46.35 v57.15,60.33
VCC  (via drill 0.6)
  Top 0.508: R18.2 71.44,17.14 V4.14 66.67,17.14 v66.04,17.78 | IC5.2 18.21,6.78 | 16.62,16.62 18.41,18.41 22.86,18.41 | 22.86,18.41 24.13,17.14 IC3.16 | IC4.14 36.2,17.14 34.92,18.41 | 22.86,18.41 34.92,18.41 | R12.2 60.01,67.62 60.96,66.67 | 60.96,66.67 62.23,66.67 63.5,65.41 63.5,57.78 | 63.5,34.92 v63.5,28.57 60.96,28.57 60.33,29.21 60.33,30.16 R17.2 | 63.5,34.92 63.5,42.55 | 63.5,42.55 63.5,50.16 | 63.5,50.16 63.5,57.78 | R13.2 60.01,60.01 60.96,59.05 62.23,59.05 63.5,57.78 | R14.2 60.01,52.38 60.96,51.44 | 60.96,51.44 62.23,51.44 63.5,50.16 | R15.2 60.01,44.77 60.96,43.81 62.23,43.81 63.5,42.55 | R16.2 60.01,37.15 60.96,36.2 62.23,36.2 63.5,34.92 | v12.06,22.23 12.06,27.3 | 12.06,27.3 12.06,34.92 | 12.06,34.92 12.06,42.55 | 12.06,42.55 12.06,50.16 | 12.06,50.16 12.06,57.78 13.34,59.05 15.24,59.05 16.19,60.01 R1.2 | R2.2 16.19,52.38 15.24,51.44 13.34,51.44 12.06,50.16 | R3.2 16.19,44.77 15.24,43.81 13.34,43.81 12.06,42.55 | R4.2 16.19,37.15 15.24,36.2 13.34,36.2 12.06,34.92 | R5.2 16.19,29.52 15.24,28.57 13.34,28.57 12.06,27.3 | R6.2 39.05,67.62 v38.1,66.67 | 34.92,18.41 v34.92,21.59 | R7.2 39.05,60.01 v38.1,59.05 | R8.2 39.05,52.38 v38.1,51.44 35.56,51.44 32.38,48.26 V3.14 | R9.2 39.05,44.77 v38.1,43.81 | R10.2 39.05,37.15 v38.1,36.2 | R11.2 39.05,29.52 v38.1,28.57 34.29,28.57 32.38,30.48 IC2.14 | 34.92,18.41 36.2,19.68 v59.05,19.68 | 16.62,17.67 v16.51,17.78 | V1.14 53.98,30.48 v55.88,28.57 | IC1.14 53.98,48.26 57.15,51.44 60.96,51.44 | V2.14 60.33,66.04 60.96,66.67
  Top 0.813: 18.21,6.78 19.05,7.62 19.05,12.81 C7.+ 16.62,16.62 16.62,17.67
  Bottom 0.508: v38.1,66.67 v38.1,59.05 v38.1,51.44 v38.1,43.81 v38.1,36.2 v38.1,28.57 38.1,24.77 v34.92,21.59 | v59.05,19.68 59.69,19.68 62.87,16.51 64.77,16.51 v66.04,17.78 63.5,20.32 v63.5,28.57 v55.88,28.57 | v16.51,17.78 v12.06,22.23

### Text on the board
tDocu: Binary Clock | v2 | Cruz Monrreal II | 02/06/11 | Hour | Min | Sec